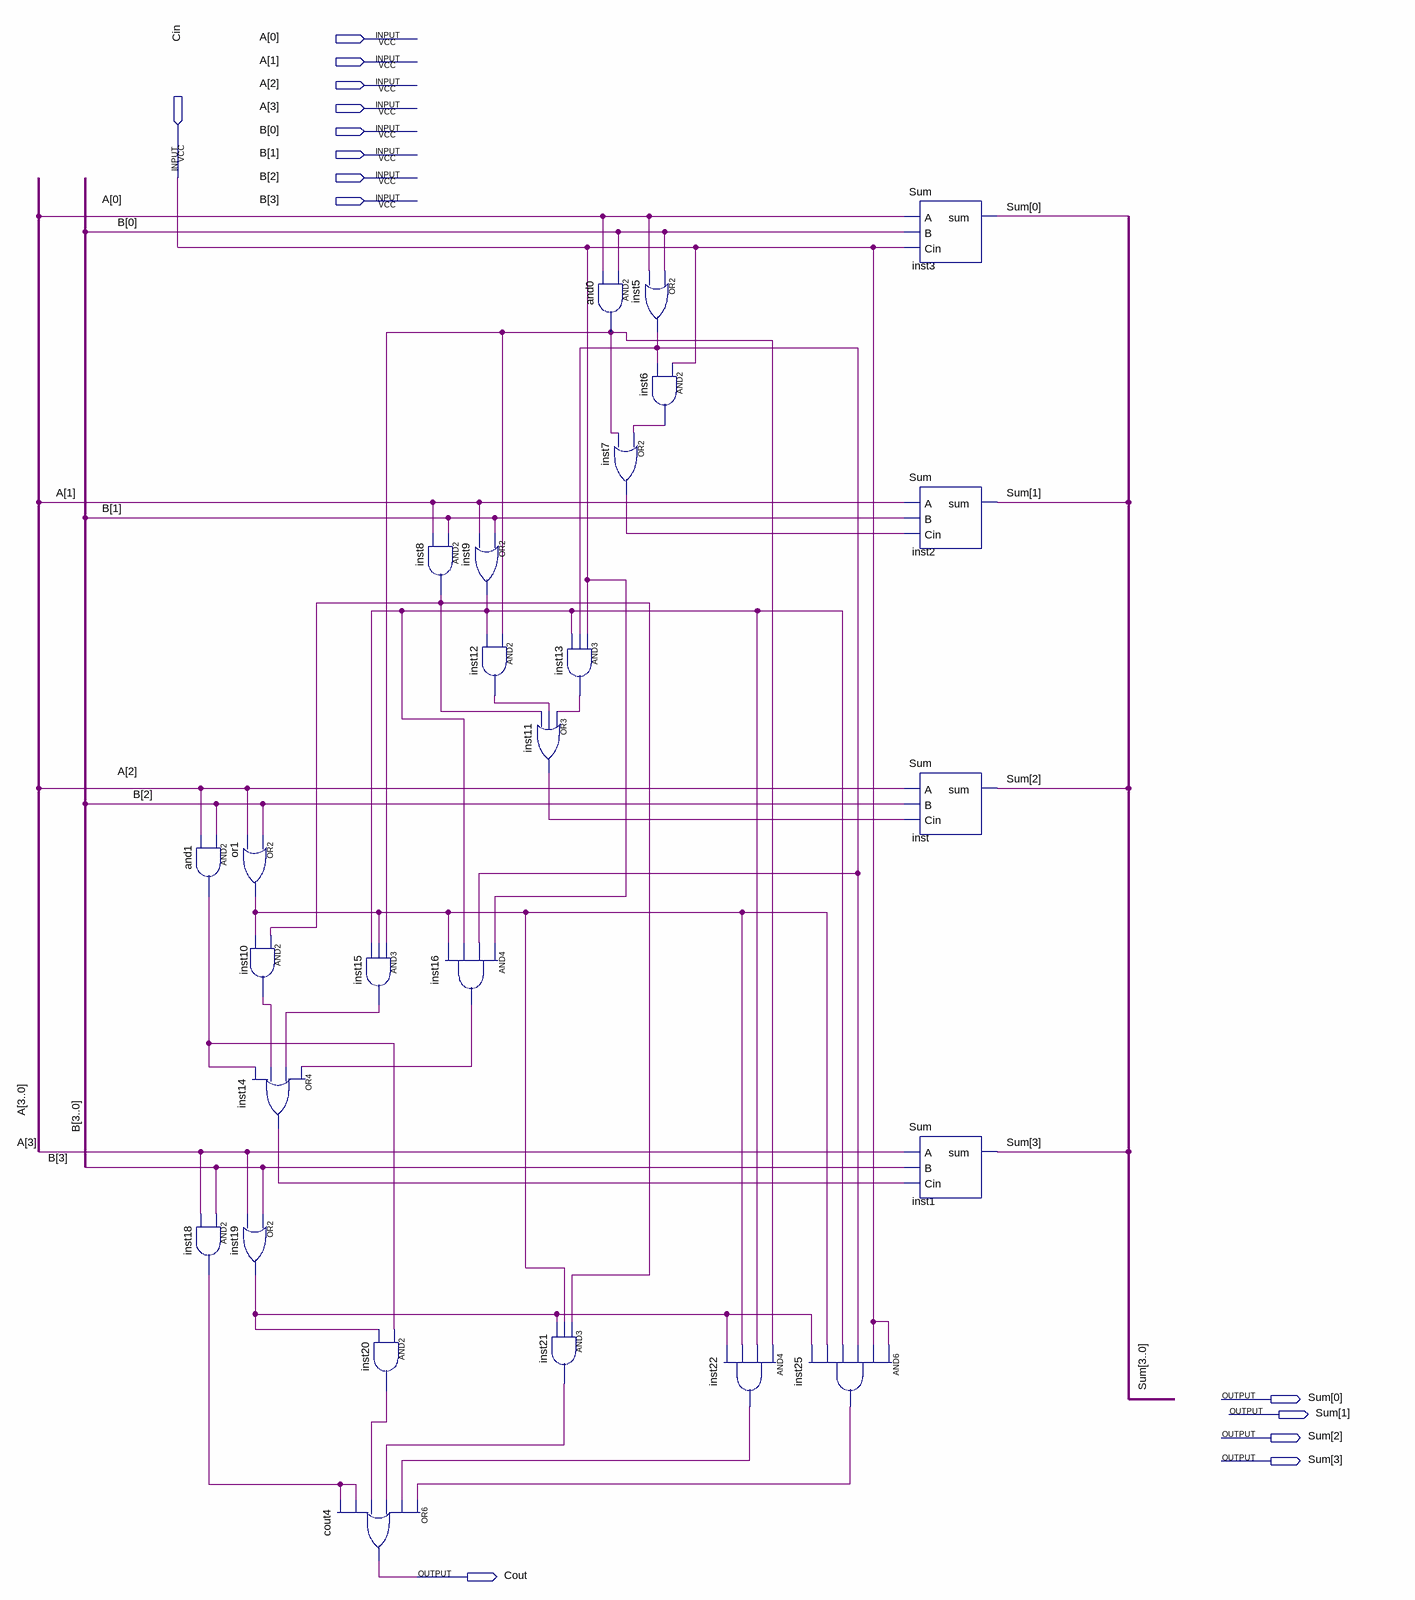
[diagram p0: schematic sheet]
// Quartus schematic fourbitadder-mult.bdf as structural Verilog: 26 symbols, 14 pins
module \fourbitadder-mult  (
  input  [3:0] A,
  input  [3:0] B,
  input  Cin,
  output [3:0] Sum,
  output Cout
);

  wire and0_out, and1_out, inst5_out, inst6_out, inst7_out, inst8_out, inst9_out, inst10_out, inst11_out,
       inst12_out, inst13_out, inst14_out, inst15_out, inst16_out, inst18_out, inst19_out, inst20_out,
       inst21_out, inst22_out, inst25_out, or1_out;

  and and1 (and1_out, B[2], A[2]);
  and inst18 (inst18_out, B[3], A[3]);
  or or1 (or1_out, B[2], A[2]);
  and inst10 (inst10_out, inst8_out, or1_out);
  or inst14 (inst14_out, inst16_out, inst15_out, inst10_out, and1_out);
  or inst19 (inst19_out, B[3], A[3]);
  or cout4 (Cout, inst25_out, inst22_out, inst21_out, inst20_out, inst18_out, inst18_out);
  and inst15 (inst15_out, and0_out, or1_out, inst9_out);
  and inst20 (inst20_out, and1_out, inst19_out);
  and inst8 (inst8_out, B[1], A[1]);
  and inst16 (inst16_out, Cin, inst5_out, inst9_out, or1_out);
  or inst9 (inst9_out, B[1], A[1]);
  and inst12 (inst12_out, and0_out, inst9_out);
  and inst13 (inst13_out, Cin, inst5_out, inst9_out);
  or inst11 (inst11_out, inst13_out, inst12_out, inst8_out);
  and inst21 (inst21_out, inst8_out, or1_out, inst19_out);
  or inst5 (inst5_out, B[0], A[0]);
  and and0 (and0_out, B[0], A[0]);
  and inst6 (inst6_out, Cin, inst5_out);
  or inst7 (inst7_out, inst6_out, and0_out);
  and inst22 (inst22_out, and0_out, inst9_out, or1_out, inst19_out);
  and inst25 (inst25_out, Cin, Cin, inst5_out, inst9_out, or1_out, inst19_out);
  Sum inst3 (.A(A[0]), .B(B[0]), .Cin(Cin), .sum(Sum[0]));
  Sum inst2 (.A(A[1]), .B(B[1]), .Cin(inst7_out), .sum(Sum[1]));
  Sum inst (.A(A[2]), .B(B[2]), .Cin(inst11_out), .sum(Sum[2]));
  Sum inst1 (.A(A[3]), .B(B[3]), .Cin(inst14_out), .sum(Sum[3]));
endmodule
